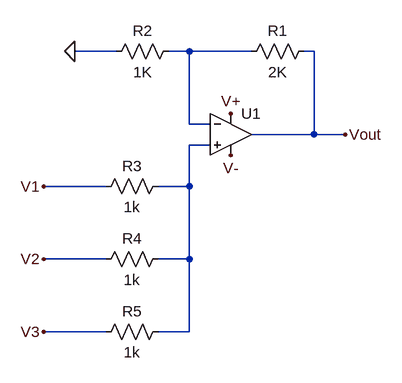
[diagram p0: schematic 3_Input_Summer.asc]
3_Input_Summer.asc, the LTspice schematic file:
Version 4.1
SHEET 1 880 768
WIRE -48 -16 -112 -16
WIRE 64 -16 32 -16
WIRE 160 -16 64 -16
WIRE 256 -16 240 -16
WIRE 64 96 64 -16
WIRE 96 96 64 96
WIRE 256 112 256 -16
WIRE 256 112 160 112
WIRE 304 112 256 112
WIRE 96 128 64 128
WIRE -64 192 -160 192
WIRE 64 192 64 128
WIRE 64 192 16 192
WIRE -64 304 -160 304
WIRE 64 304 64 192
WIRE 64 304 16 304
WIRE -64 416 -160 416
WIRE 64 416 64 304
WIRE 64 416 16 416
FLAG -112 -16 0
FLAG 304 112 Vout
FLAG -160 192 V1
FLAG -160 304 V2
FLAG -160 416 V3
FLAG 128 80 V+
FLAG 128 144 V-
SYMBOL OpAmps\\UniversalOpAmp 128 112 R0
SYMATTR InstName U1
SYMBOL res 256 -32 R90
WINDOW 0 0 56 VBottom 2
WINDOW 3 32 56 VTop 2
SYMATTR InstName R1
SYMATTR Value 2K
SYMBOL res 48 -32 R90
WINDOW 0 0 56 VBottom 2
WINDOW 3 32 56 VTop 2
SYMATTR InstName R2
SYMATTR Value 1K
SYMBOL res 32 176 R90
WINDOW 0 0 56 VBottom 2
WINDOW 3 32 56 VTop 2
SYMATTR InstName R3
SYMATTR Value 1k
SYMBOL res 32 288 R90
WINDOW 0 0 56 VBottom 2
WINDOW 3 32 56 VTop 2
SYMATTR InstName R4
SYMATTR Value 1k
SYMBOL res 32 400 R90
WINDOW 0 0 56 VBottom 2
WINDOW 3 32 56 VTop 2
SYMATTR InstName R5
SYMATTR Value 1k

The netlist it stands for:
* 3_Input_Summer.asc
X§U1 N002 N001 V+ V- Vout level1 Avol=1Meg GBW=10Meg Vos=0 En=0 Enk=0 In=0 Ink=0 Rin=500Meg  ; pins In+ In- V+ V- OUT
R1 Vout N001 2K
R2 N001 0 1K
R3 N002 V1 1k
R4 N002 V2 1k
R5 N002 V3 1k
.lib UniversalOpAmp1.lib
.backanno
.end